# Altium schematic sheet Connectors.SchDoc: Sample Sheet Title
size B; Date: MM/DD/YYYY; Author: Sample Author; Organization: ORGANIZATION; Address1: ADDRESS 1; Address2: ADDRESS 2; Address3: ADDRESS 3; Address4: ADDRESS 4; Revision: -; SheetNumber: 2; SheetTotal: 2; ENG_APP_DATE: --/--/--; DSN_APP_DATE: --/--/--; CHK_APP_DATE: --/--/--
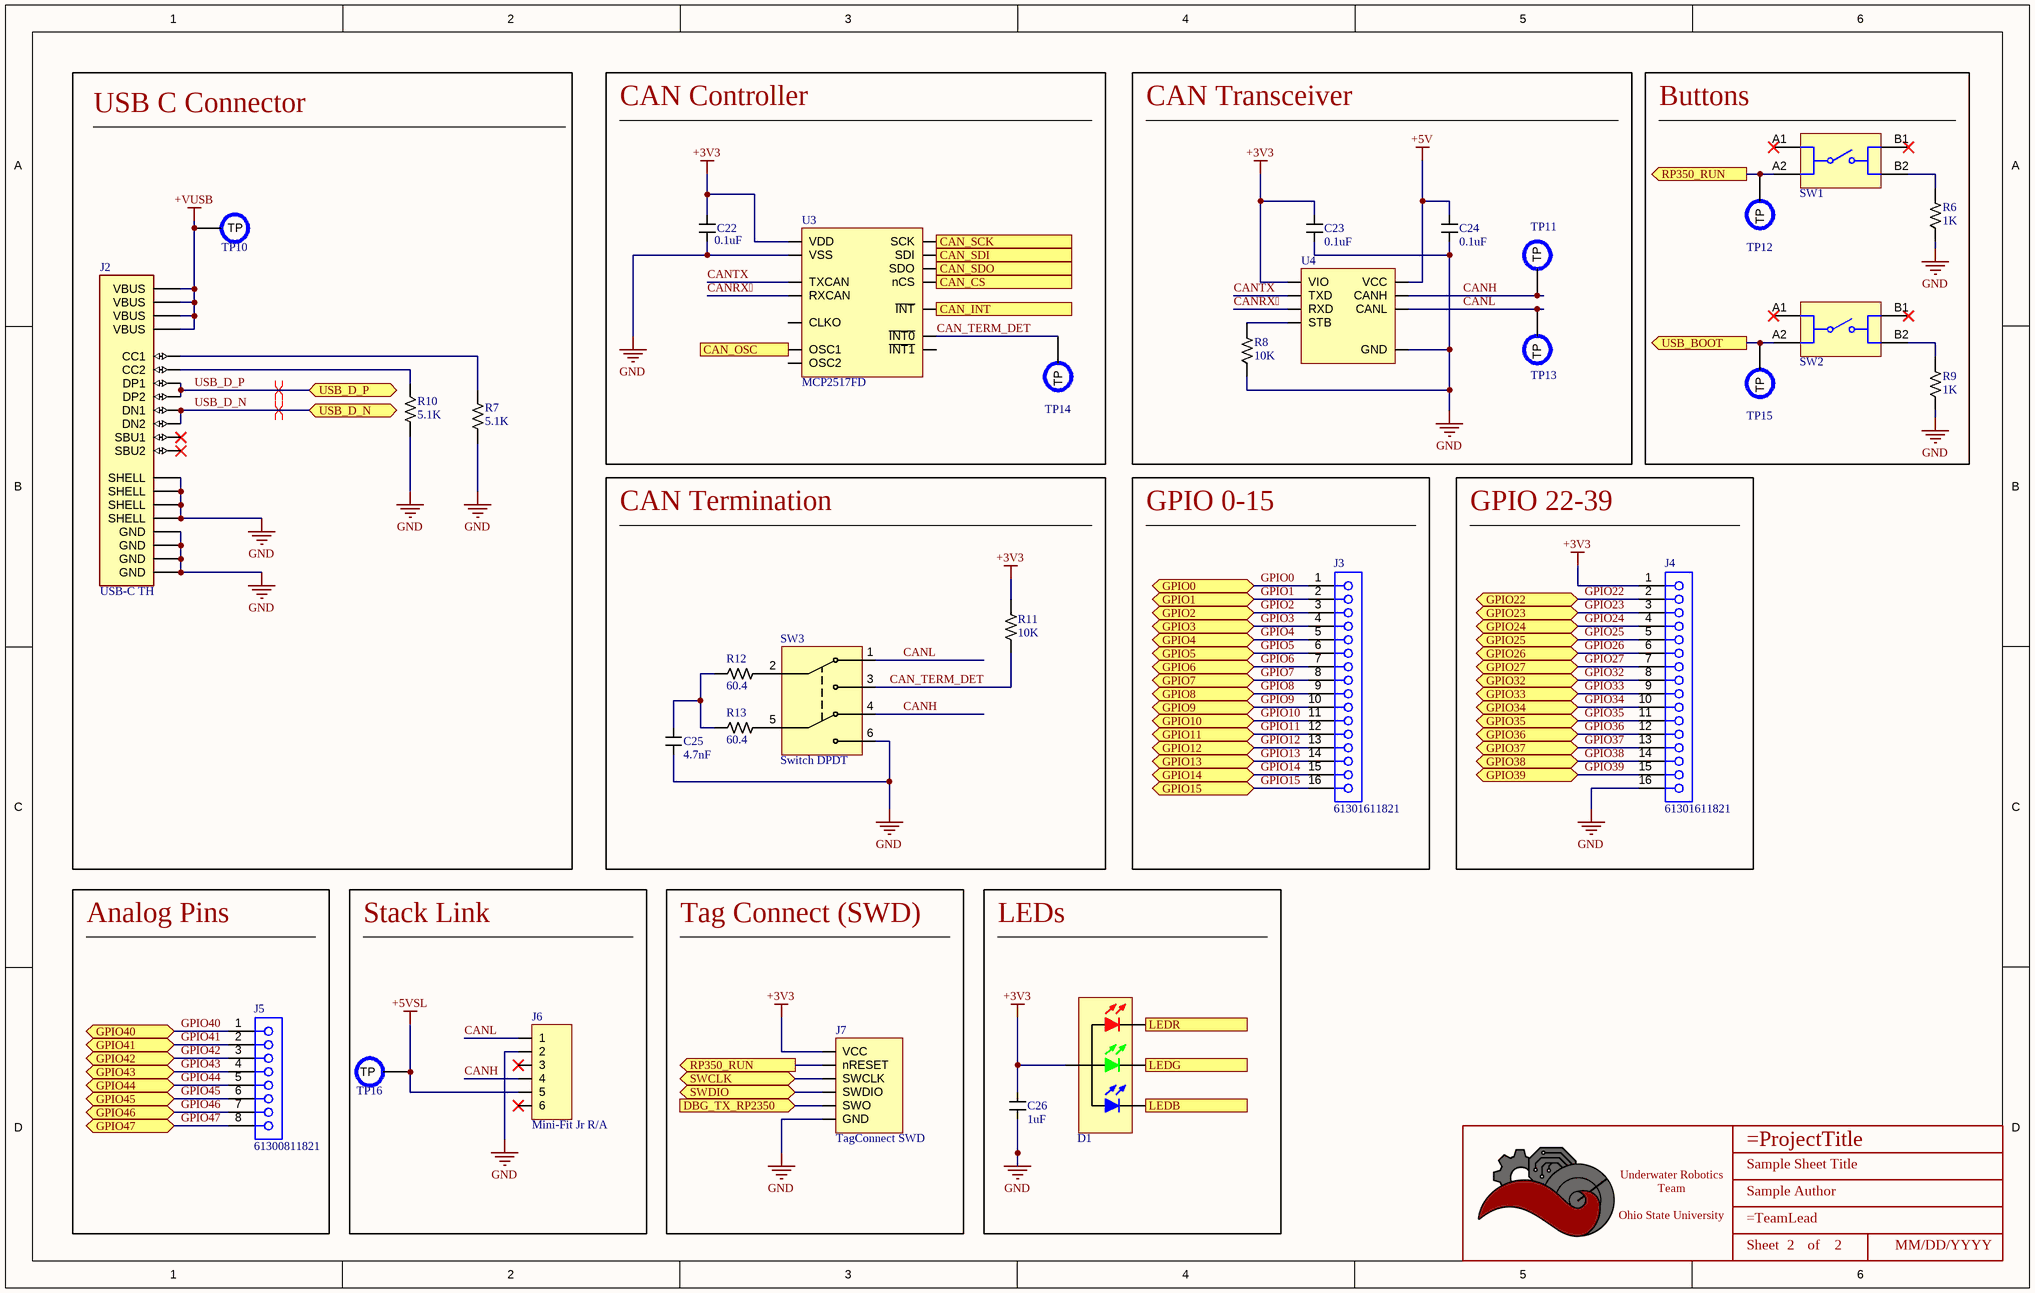
[diagram p0: Connectors.SchDoc]

## Parts
*  Title_Block  [LOGO]  (value not drawn)  (graphical)
C22  value 0.1uF  [CAPACITOR_0603]  (hidden comment: 100nF Ceramic 25V)
C23  value 0.1uF  [CAPACITOR_0603]  (hidden comment: 100nF Ceramic 25V)
C24  value 0.1uF  [CAPACITOR_0603]  (hidden comment: 100nF Ceramic 25V)
C25  value 4.7nF  [CAPACITOR_0402]  (hidden comment: 4700pF Ceramic 25V)
C26  value 1uF  [CAPACITOR_0603]  (hidden comment: 1uF Ceramic 16V)
D1  EAST1616RGBB4  [LED_0606_4SMD]  (value not drawn)
J2  USB-C TH  [USB-C TH]
J3  61301611821  [61301611821]
J4  61301611821  [61301611821]
J5  61300811821  [61300811821]
J6  Mini-Fit Jr R/A  [CONN_MOLEX_MINIFIT JR_6 POS_R/A]
J7  TagConnect SWD  [TC2030-MCP]  (no BOM)
R6  Value  (Ohms): 1K  [RESISTOR_0603]  (hidden comment: 1k Ohm 5% 1/8W)
R7  Value  (Ohms): 5.1K  [RESISTOR_0805]  (hidden comment: 5.1k Ohm 1% 1/8W)
R8  Value  (Ohms): 10K  [RESISTOR_0402]  (hidden comment: 10k Ohm 1% 1/16W)
R9  Value  (Ohms): 1K  [RESISTOR_0603]  (hidden comment: 1k Ohm 5% 1/8W)
R10  Value  (Ohms): 5.1K  [RESISTOR_0805]  (hidden comment: 5.1k Ohm 1% 1/8W)
R11  Value  (Ohms): 10K  [RESISTOR_0402]  (hidden comment: 10k Ohm 1% 1/16W)
R12  Value  (Ohms): 60.4  [RESISTOR_0402]  (hidden comment: 60.4 Ohm 1% 1/16W)
R13  Value  (Ohms): 60.4  [RESISTOR_0402]  (hidden comment: 60.4 Ohm 1% 1/16W)
SW1  434123025826  [SMD_434123025826]  (value not drawn)
SW2  434123025826  [SMD_434123025826]  (value not drawn)
SW3  Switch DPDT  [CAS-220TA]
TP10  PCB Test Point  [TESTPOINT_1.2MM]  (value not drawn)  (no BOM)
TP11  PCB Test Point  [TESTPOINT_1.2MM]  (value not drawn)  (no BOM)
TP12  PCB Test Point  [TESTPOINT_1.2MM]  (value not drawn)  (no BOM)
TP13  PCB Test Point  [TESTPOINT_1.2MM]  (value not drawn)  (no BOM)
TP14  PCB Test Point  [TESTPOINT_1.2MM]  (value not drawn)  (no BOM)
TP15  PCB Test Point  [TESTPOINT_1.2MM]  (value not drawn)  (no BOM)
TP16  PCB Test Point  [TESTPOINT_1.2MM]  (value not drawn)  (no BOM)
U3  MCP2517FD  [SOIC-14]
U4  CAN Transceiver  [SOIC-8]  (value not drawn)

## Blocks framed on the sheet
USB C Connector: J2 R7 R10 TP10
CAN Controller: C22 TP14 U3
CAN Transceiver: C23 C24 R8 TP11 TP13 U4
Buttons: R6 R9 SW1 SW2 TP12 TP15
CAN Termination: C25 R11-R13 SW3
GPIO 0-15: J3
GPIO 22-39: J4
Analog Pins: J5
Stack Link: J6 TP16
Tag Connect (SWD): J7
LEDs: C26 D1

## Ports
CAN_CS (in), CAN_INT (out), CAN_OSC (in), CAN_SCK (in), CAN_SDI (in), CAN_SDO (out), DBG_TX_RP2350 (in), GPIO0 (bidir), GPIO1 (bidir), GPIO2 (bidir), GPIO3 (bidir), GPIO4 (bidir), GPIO5 (bidir), GPIO6 (bidir), GPIO7 (bidir), GPIO8 (bidir), GPIO9 (bidir), GPIO10 (bidir), GPIO11 (bidir), GPIO12 (bidir), GPIO13 (bidir), GPIO14 (bidir), GPIO15 (bidir), GPIO22 (bidir), GPIO23 (bidir), GPIO24 (bidir), GPIO25 (bidir), GPIO26 (bidir), GPIO27 (bidir), GPIO32 (bidir), GPIO33 (bidir), GPIO34 (bidir), GPIO35 (bidir), GPIO36 (bidir), GPIO37 (bidir), GPIO38 (bidir), GPIO39 (bidir), GPIO40 (bidir), GPIO41 (bidir), GPIO42 (bidir), GPIO43 (bidir), GPIO44 (bidir), GPIO45 (bidir), GPIO46 (bidir), GPIO47 (bidir), LEDB (out), LEDG (out), LEDR (out), RP350_RUN (out), SWCLK (bidir), SWDIO (bidir), USB_BOOT (out), USB_D_N (bidir), USB_D_P (bidir)

## Nets
+3V3: C22.1 C23.1 C26.1 D1.4 J4.1 J7.2(VCC) R11.1 U3.14(VDD) U4.5(VIO)
+5V: C24.1 U4.3(VCC)
+5VSL: J6.5 TP16.TP
+VUSB: J2.A4(VBUS) J2.A9(VBUS) J2.B4(VBUS) J2.B9(VBUS) TP10.TP
GND: C22.2 C23.2 C24.2 C25.2 C26.2 J2.A1(GND) J2.A12(GND) J2.B1(GND) J2.B12(GND) J2.S1(SHELL) J2.S2(SHELL) J2.S3(SHELL) J2.S4(SHELL) J4.16 J6.2 J7.6(GND) R6.2 R7.1 R8.2 R9.2 R10.1 SW3.6 U3.7(VSS) U4.2(GND)
CAN_CS: U3.13(nCS) ; port CAN_CS
CAN_INT: U3.4(~{INT}) ; port CAN_INT
CAN_OSC: U3.6(OSC1) ; port CAN_OSC
CAN_SCK: U3.10(SCK) ; port CAN_SCK
CAN_SDI: U3.11(SDI) ; port CAN_SDI
CAN_SDO: U3.12(SDO) ; port CAN_SDO
CAN_TERM_DET: R11.2 SW3.3 TP14.TP U3.9(~{INT0})
CANH: J6.4 SW3.4 TP11.TP U4.7(CANH)
CANL: J6.1 SW3.1 TP13.TP U4.6(CANL)
CANRX: U3.2(RXCAN) U4.4(RXD)
CANTX: U3.1(TXCAN) U4.1(TXD)
DBG_TX_RP2350: J7.5(SWO) ; port DBG_TX_RP2350
GPIO0: J3.1 ; port GPIO0
GPIO1: J3.2 ; port GPIO1
GPIO2: J3.3 ; port GPIO2
GPIO3: J3.4 ; port GPIO3
GPIO4: J3.5 ; port GPIO4
GPIO5: J3.6 ; port GPIO5
GPIO6: J3.7 ; port GPIO6
GPIO7: J3.8 ; port GPIO7
GPIO8: J3.9 ; port GPIO8
GPIO9: J3.10 ; port GPIO9
GPIO10: J3.11 ; port GPIO10
GPIO11: J3.12 ; port GPIO11
GPIO12: J3.13 ; port GPIO12
GPIO13: J3.14 ; port GPIO13
GPIO14: J3.15 ; port GPIO14
GPIO15: J3.16 ; port GPIO15
GPIO22: J4.2 ; port GPIO22
GPIO23: J4.3 ; port GPIO23
GPIO24: J4.4 ; port GPIO24
GPIO25: J4.5 ; port GPIO25
GPIO26: J4.6 ; port GPIO26
GPIO27: J4.7 ; port GPIO27
GPIO32: J4.8 ; port GPIO32
GPIO33: J4.9 ; port GPIO33
GPIO34: J4.10 ; port GPIO34
GPIO35: J4.11 ; port GPIO35
GPIO36: J4.12 ; port GPIO36
GPIO37: J4.13 ; port GPIO37
GPIO38: J4.14 ; port GPIO38
GPIO39: J4.15 ; port GPIO39
GPIO40: J5.1 ; port GPIO40
GPIO41: J5.2 ; port GPIO41
GPIO42: J5.3 ; port GPIO42
GPIO43: J5.4 ; port GPIO43
GPIO44: J5.5 ; port GPIO44
GPIO45: J5.6 ; port GPIO45
GPIO46: J5.7 ; port GPIO46
GPIO47: J5.8 ; port GPIO47
LEDB: D1.3 ; port LEDB
LEDG: D1.2 ; port LEDG
LEDR: D1.1 ; port LEDR
RP350_RUN: J7.4(nRESET) SW1.A2 TP12.TP ; port RP350_RUN
SWCLK: J7.3(SWCLK) ; port SWCLK
SWDIO: J7.1(SWDIO) ; port SWDIO
USB_BOOT: SW2.A2 TP15.TP ; port USB_BOOT
USB_D_N: J2.A7(DN1) J2.B7(DN2) ; port USB_D_N
USB_D_P: J2.A6(DP1) J2.B6(DP2) ; port USB_D_P
NetC25_1: C25.1 R12.2 R13.2
NetJ2_A5: J2.A5(CC1) R7.2
NetJ2_B5: J2.B5(CC2) R10.2
NetR6_1: R6.1 SW1.B2
NetR8_1: R8.1 U4.8(STB)
NetR9_1: R9.1 SW2.B2
NetR12_1: R12.1 SW3.2
NetR13_1: R13.1 SW3.5

Not connected (* = marked no-connect by the designer): J2 A8(SBU1)* B8(SBU2)*; J6 3* 6*; SW1 A1* B1*; SW2 A1* B1*; U3 3(CLKO) 5(OSC2) 8(~{INT1})

## Layout directives
differential pair: USB_D_N, USB_D_P

## Notes on the sheet
- DWG. NO.
- REV.
- SHT.
- THIS DOCUMENT AND THE DATA DISCLOSED HEREIN OR HEREWITH IS THE PROPERTY OF ALTIUM LIMITED AND MAY BE FREELY DISTRIBUTED IN WHOLE. NO RIGHTS ARE RESERVED OR EXPRESS OR IMPLIED WARANTEE GIVEN.
- REVISION
- DESCRIPTION
- DATE
- APPROVED
- ENG:
- APPROVALS
- PROJECT
- DSN:
- CHK:
- REFERENCE DOCUMENTS
- PROJECT REVISION:
- TITLE
- DOCUMENT REVISION:
- DESIGN ITEM:
- BOM:
- FAB DWG:
- PCB DWG:
- ASSY DWG:
- SCALE:
- SIZE
- B
- CAGE CODE
- FILE NAME
- DWG NO.
- SHEET
- OF
- REV
- (in symbol Title_Block) Underwater Robotics Team / Ohio State University; Sheet; of

## Library data of the parts
* = Title_Block: UWRT Schematic Title Block Template / Created June 2021, Dylan Trainor
C22-C24 = CAPACITOR_0.1uF_0603_25V: Cap 100nF 25V +/-10% / Ceramic 0603; Voltage: 6.3V; Made By: Flip B; ComponentLink1Description: Datsheet; ComponentLink1URL: https://www.mouser.com/datasheet/2/212/KEM_C1002_X7R_SMD-1102033.pdf; Tolerance: +/- 10%; Supplier 1: Digikey; Supplier Part Number 1: 1276-1006-1-ND
C25 = CAPACITOR_0.0047uF_0402: 4700 pF +/-10% 25V Ceramic Capacitor X7R 0402; Made By: Robert Pafford; Tolerance: +/- 10%; Voltage: 25V; Supplier 1: Future Electronics; Supplier Part Number 1: 1909415
C26 = CAPACITOR_1uF_0603: Cap 1uF 16V +/-10% / Ceramic 0603; Made By: Flip B; Tolerance: +/- 10%; Voltage: 16V; Supplier 1: Arrow Electronics; Supplier Part Number 1: C1608X7R1C105K080AC
D1 = LED_RGB_4SMD: LED RGB CLEAR 4SMD; Made By: Robert Pafford; Red Forward Voltage: 1.8V; Red Forward Current: 5mA; Green Forward Voltage: 2.8V; ComponentLink1Description: Datasheet; ComponentLink1URL: https://everlightamericas.com/index.php?controller=attachment&id_attachment=3220; Package: 4-SMD; Green Forward Current: 5mA; Blue Forward Voltage: 2.8V; Blue Forward Current: 5mA; Color: RGB; Supplier 1: Digi-Key; Supplier Part Number 1: 1080-1552-1-ND
J2 = CONN_USBC_USB4085-GF-A: USB-C (USB TYPE-C) USB 2.0 Receptacle Connector 24 (16+8 Dummy) Position Through Hole, Right Angle; Supplier 1: DigiKey; Supplier Part Number 1: 2073-USB4085-GF-ADKR-ND; Created By: John Ulm; Type: Through Hole; Interface: USB-C
J3 J4 = CMP-1502-01343-3: NexarPartId: 23389750; Operating Supply Voltage: 250V; Contact Resistance: 20mΩ; Current Rating: 3A; Gender: Female; Number of Pins: 16; Orientation: Vertical; Contact Material: Copper; Lead Free: Lead Free; Lead Pitch: 2.54mm; RoHS: Compliant
J5 = CMP-1502-01327-3: NexarPartId: 61924723; Current Rating: 3A; Gender: Female; Contact Resistance: 20mΩ; Operating Supply Voltage: 250V; Lead Pitch: 2.54mm; RoHS: Non-Compliant; Orientation: Vertical; Number of Pins: 8
J6 = CONN_MOLEX_MINIFIT JR_6POS_R/A: Molex Minifit Jr. 5569 / 6 Pos R/A Natural; Pitch: 4.2mm; Configuration: Right Angle; Current Per Pin: 13A; Number of Positions: 8; Manufacturer: Molex; Color: Natural; Created By: Flip B; ComponentLink1Description: Datasheet; ComponentLink1URL: https://www.molex.com/pdm_docs/ps/PS-5556-001.pdf; Series: Minifit Jr 5569; Supplier 1: Digi-Key; Supplier Part Number 1: WM1353-ND
J7 = TC2030_SWD: TagConnect TC2030 ARM SWD 6-pin
R6 R9 = RESISTOR_1K_0603: RES 1k OHM 5% 1/8W 0603; Tolerance: +/- 5%; Made By: Robert Pafford; ComponentLink1Description: Datasheet; ComponentLink1URL: https://www.bourns.com/docs/product-datasheets/CRxxxxx.pdf; Wattage: 1/8W; Supplier: Digikey; Digikey Part Numer: CR0603-JW-104ELFTR-ND; Supplier 1: Digi-Key; Supplier Part Number 1: 2019-RK73B1JTTD102JCT-ND
R7 R10 = RESISTOR_5.1K_0805: RES 5.1k OHM 1% 1/8W 0805; Tolerance: +/- 5%; Made By: Dylan Trainor; ComponentLink1Description: Datasheet; ComponentLink1URL: https://www.bourns.com/docs/product-datasheets/CRxxxxx.pdf; Wattage: 1/8W; Supplier: Digikey; Digikey Part Numer: CR0603-JW-104ELFTR-ND; Supplier 1: Newark; Supplier Part Number 1: 53W4863
R8 R11 = RESISTOR_10K_0402: RES 10k OHM 1% 1/16W 0402; Tolerance: +/- 1%; Made By: Robert Pafford; Wattage: 1/16W; Supplier: Digikey; Digikey Part Numer: CR0603-JW-104ELFTR-ND; Supplier 1: Digi-Key; Supplier Part Number 1: YAG3436CT-ND
R12 R13 = RESISTOR_60.4_0402: RES 60.4 OHM 1% 1/16W 0402; Tolerance: +/- 1%; Made By: Robert Pafford; Wattage: 1/16W; Supplier: Digikey; Digikey Part Numer: CR0603-JW-104ELFTR-ND; Supplier 1: Digi-Key; Supplier Part Number 1: 13-AC0402FR-0760R4LCT-ND
SW1 SW2 = Tactile Switch SMD: WS-TASV J-Bend SMT Tact Switch, SPST-NO, 16VDC, 50mA, 260g; Manufacturer: Wurth Elektronik; Washable: No; ComponentLink1Description: Website Link; ComponentLink1URL: https://www.we-online.com/redexpert/article/434123025826?ad; ComponentLink2Description: Datasheet Link; ComponentLink2URL: https://www.we-online.com/redexpert/spec/434123025826?ad; Manufacturer Part Number: 434123025826; Category: Tact Switches; Match Code: WS-TASV; Mount: Surface Mount; Operating Temperature Max: 85°C; Operating Temperature Min: -40°C; Packaging: Tape and Reel; Length: 4.2mm; Width: 3.2mm; Height: 2.5mm; Circuit: SPST-NO; Contact Material: Stainless Steel; Contact Plating: Silver; Operation Force: 260g; Rated Current: 50mA; Rated Voltage: 16VDC; Terminal Material: Copper Alloy; Terminal Plating: Silver; Supplier 1: Mouser; Supplier Part Number 1: 710-434123025826
SW3 = CAS-220TA_CAN_TERM: GOLD SWITCH FLUSH SLIDE DPDT 100MA 6V; Made By: Robert Pafford; Voltage Rating: 6VDC; Current Rating: 100 mA; Switch Function: DPDT; Contact Finish: Gold; Supplier 1: Digi-Key; Supplier Part Number 1: CAS220JCT-ND
TP10-TP16 = TESTPOINT: Made By: Robert Pafford
U3 = MCP2517FD: CANbus Controller CAN 2.0 SPI Interface 14-SOIC; Made By: Robert Pafford; Max FD Rate: 8 Mbps
U4 = TJA1442AT: CAN Interface IC High-Speed CAN Transceiver with Standby Mode; Made By: Robert Pafford; Max Data Rate: 5Mbps; Supplier 1: Mouser; Supplier Part Number 1: 771-TJA1442AT/0Z